# EAGLE design breakout-4x-step-down (EAGLE 7.5.0)
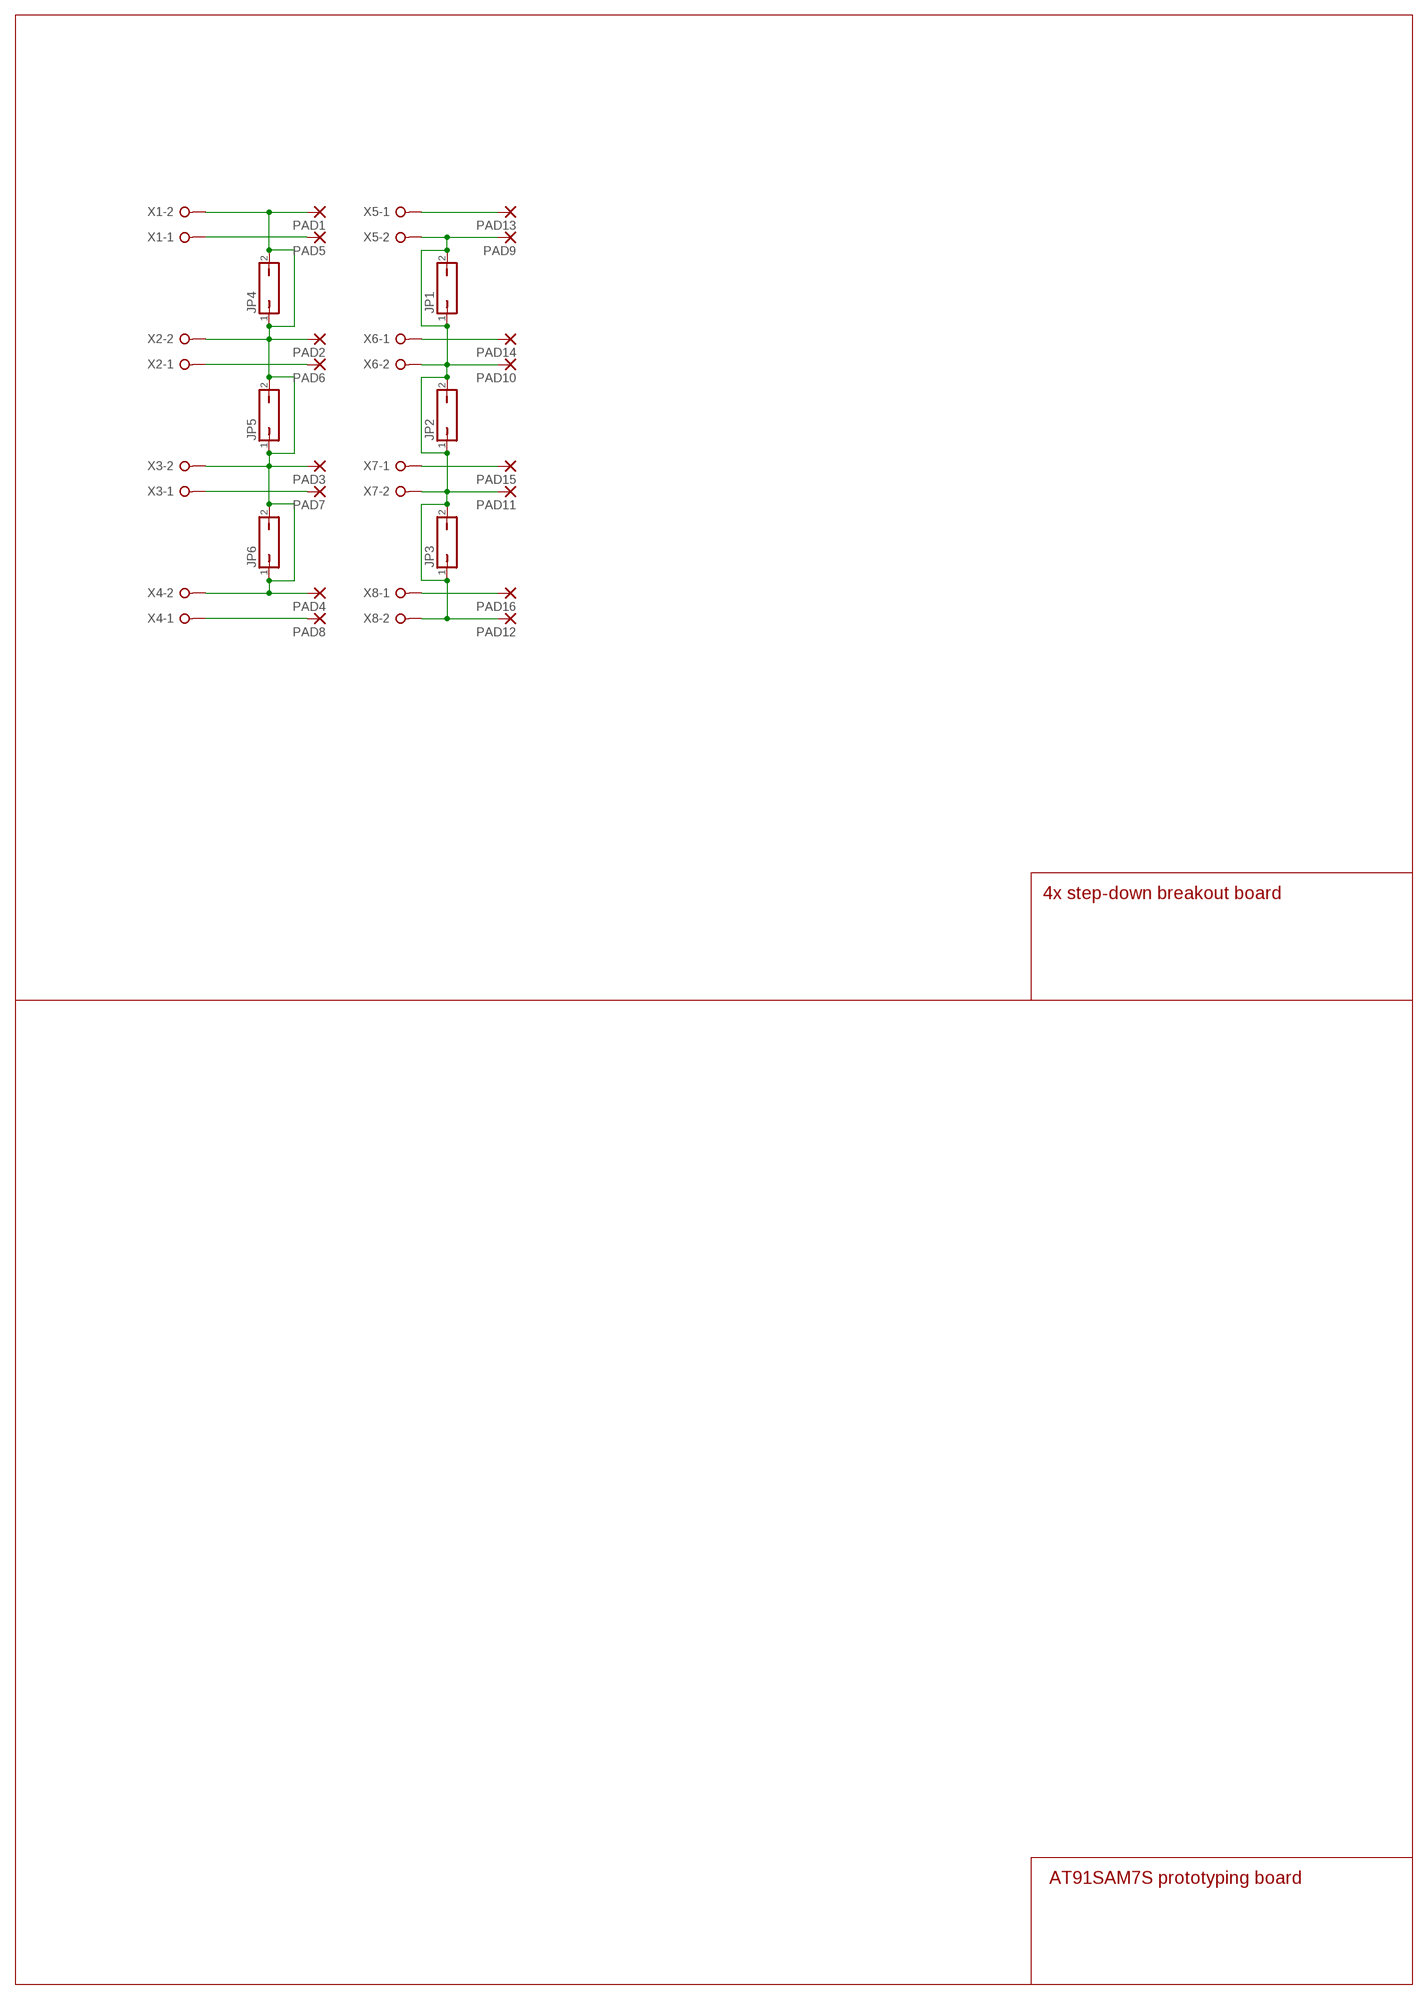
[diagram p0: schematic, sheet 1]

## Parts
JP1  JP1Q  [JP1]
JP2  JP1Q  [JP1]
JP3  JP1Q  [JP1]
JP4  JP1Q  [JP1]
JP5  JP1Q  [JP1]
JP6  JP1Q  [JP1]
PAD1  1,6/0,8  [1,6/0,8]
PAD2  1,6/0,8  [1,6/0,8]
PAD3  1,6/0,8  [1,6/0,8]
PAD4  1,6/0,8  [1,6/0,8]
PAD5  1,6/0,8  [1,6/0,8]
PAD6  1,6/0,8  [1,6/0,8]
PAD7  1,6/0,8  [1,6/0,8]
PAD8  1,6/0,8  [1,6/0,8]
PAD9  1,6/0,8  [1,6/0,8]
PAD10  1,6/0,8  [1,6/0,8]
PAD11  1,6/0,8  [1,6/0,8]
PAD12  1,6/0,8  [1,6/0,8]
PAD13  1,6/0,8  [1,6/0,8]
PAD14  1,6/0,8  [1,6/0,8]
PAD15  1,6/0,8  [1,6/0,8]
PAD16  1,6/0,8  [1,6/0,8]
X1  W237-02P  [W237-132]
X2  W237-02P  [W237-132]
X3  W237-02P  [W237-132]
X4  W237-02P  [W237-132]
X5  W237-02P  [W237-132]
X6  W237-02P  [W237-132]
X7  W237-02P  [W237-132]
X8  W237-02P  [W237-132]

## Nets
N$5: JP4.1 JP4.2 JP5.1 JP5.2 JP6.1 JP6.2 PAD1.1(P) PAD2.1(P) PAD3.1(P) PAD4.1(P) X1.2 X2.2 X3.2 X4.2
N$7: PAD5.1(P) X1.1
N$8: JP1.1 JP1.2 JP2.1 JP2.2 JP3.1 JP3.2 PAD9.1(P) PAD10.1(P) PAD11.1(P) PAD12.1(P) X5.2 X6.2 X7.2 X8.2
N$9: PAD6.1(P) X2.1
N$11: PAD7.1(P) X3.1
N$12: PAD8.1(P) X4.1
N$13: PAD16.1(P) X8.1
N$14: PAD15.1(P) X7.1
N$15: PAD14.1(P) X6.1
N$16: PAD13.1(P) X5.1

## Notes on the sheet
- 4x step-down breakout board
- AT91SAM7S prototyping board

## Library data of the parts
JP1-JP6 = jumper:JP1Q: JUMPER
PAD1-PAD16 = wirepad:1,6/0,8: THROUGH-HOLE PAD
X1-X8 = con-wago-508:W237-02P: WAGO SREW CLAMP; OC_FARNELL: unknown; OC_NEWARK: unknown

## Board
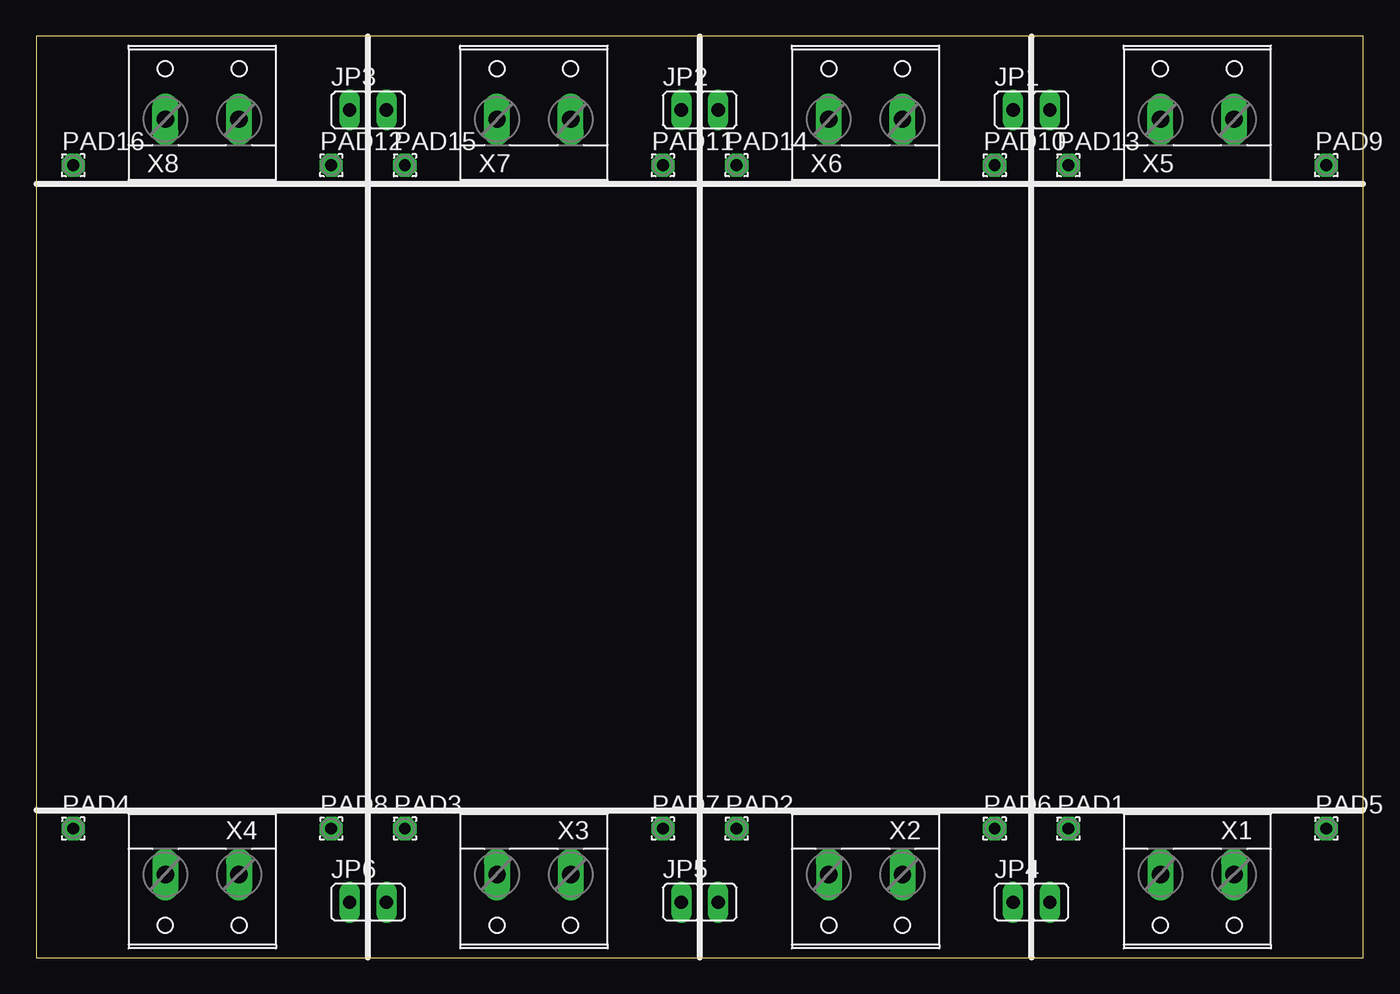
[diagram p1: board, top side]
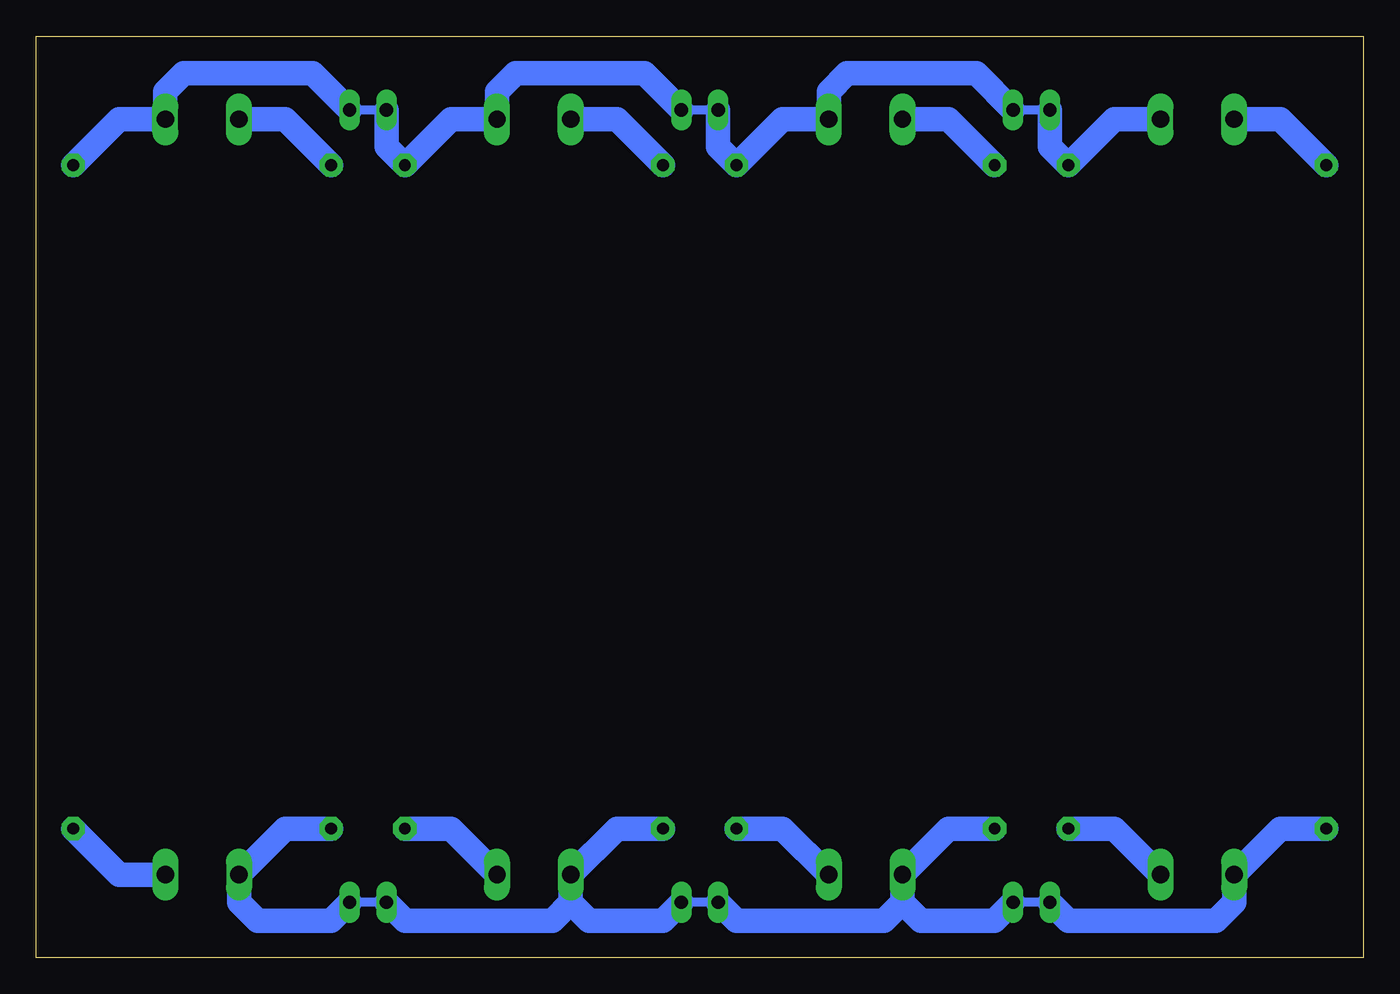
[diagram p2: board, bottom side, seen from below]

Size 91.45 x 63.51 mm. Coordinates in mm from the lower left corner, seen from the top.
Outline: 0.01,0 91.45,0 91.45,63.5 0,63.51 0.01,0
Copper layers (1*16): Top 0.035mm / dielectric 1.5mm / Bottom 0.035mm
Design rules "default": minimum track width 10mil, minimum drill 24mil, track to track 8mil, track to pad 8mil, pad to pad 8mil, via to via 8mil, smd to smd 8mil, copper to edge 40mil, drill to drill 8mil, minimum pad ring 10mil, minimum via ring 8mil, stop-mask expansion 4mil, vias tented up to drill 0mil, thermal gap 10mil

### Footprints (pad centres in the part's own frame; a part is rotated, then mirrored left to right if it is on the bottom)
JP1 = drill 0.914 long: 1 0,-1.27; 2 0,1.27
1,6/0,8 = drill 0.813 pad 1.6 octagon: 1 0,0
W237-132 = drill 1.194 long: 1 -2.54,-0.635; 2 2.54,-0.635

### Placement (x,y rotation side)
JP1  68.59,58.43 270 top
JP2  45.73,58.43 270 top
JP3  22.87,58.43 270 top
JP4  68.59,3.82 270 top
JP5  45.73,3.82 270 top
JP6  22.87,3.82 270 top
PAD1  71.13,8.9 0 top
PAD2  48.27,8.9 0 top
PAD3  25.41,8.9 0 top
PAD4  2.55,8.9 0 top
PAD5  88.91,8.9 0 top
PAD6  66.05,8.9 0 top
PAD7  43.19,8.9 0 top
PAD8  20.33,8.9 0 top
PAD9  88.91,54.62 0 top
PAD10  66.05,54.62 0 top
PAD11  43.19,54.62 0 top
PAD12  20.33,54.62 0 top
PAD13  71.13,54.62 0 top
PAD14  48.27,54.62 0 top
PAD15  25.41,54.62 0 top
PAD16  2.55,54.62 0 top
X1  80.02,5.09 180 top
X2  57.16,5.09 180 top
X3  34.3,5.09 180 top
X4  11.44,5.09 180 top
X5  80.02,58.43 0 top
X6  57.16,58.43 0 top
X7  34.3,58.43 0 top
X8  11.44,58.43 0 top

### Tracks (layer width: path | path; a pad name or v marks a point on that pad's centre or on a via)
N$5
  Bottom 0.61: JP6.1 JP6.2 | JP5.1 JP5.2 | JP4.1 JP4.2
  Bottom 1.676: PAD4.1 5.72,8.9 X4.2 8.9,3.82 10.17,2.55 20.33,2.55 JP6.1 | PAD3.1 28.58,8.9 X3.2 31.76,3.82 | PAD2.1 51.44,8.9 X2.2 54.62,3.82 | PAD1.1 74.3,8.9 X1.2 77.48,3.82 76.21,2.55 71.13,2.55 JP4.2 | 31.76,3.82 33.03,2.55 43.19,2.55 JP5.1 | 54.62,3.82 55.89,2.55 66.05,2.55 JP4.1 | JP5.2 48.27,2.55 53.35,2.55 54.62,3.82 | JP6.2 25.41,2.55 30.49,2.55 31.76,3.82
N$7
  Bottom 1.676: X1.1 85.73,5.72 PAD5.1
N$8
  Bottom 0.61: JP1.1 JP1.2 | JP2.1 JP2.2 | JP3.1 JP3.2
  Bottom 1.676: X8.2 17.15,57.79 PAD12.1 21.6,55.89 JP3.1 | PAD9.1 85.73,57.79 X5.2 82.56,59.7 81.29,60.97 72.4,60.97 JP1.2 | JP3.2 26.68,60.97 35.57,60.97 36.84,59.7 X7.2 40.01,57.79 PAD11.1 44.46,55.89 JP2.1 | JP2.2 49.54,60.97 58.43,60.97 59.7,59.7 X6.2 62.87,57.79 PAD10.1 67.32,55.89 JP1.1
N$9
  Bottom 1.676: PAD6.1 62.87,8.9 X2.1
N$11
  Bottom 1.676: PAD7.1 40.01,8.9 X3.1
N$12
  Bottom 1.676: 14.61,6.36 X4.1 17.15,8.9 PAD8.1
N$13
  Bottom 1.676: X8.1 5.72,57.79 PAD16.1
N$14
  Bottom 1.676: X7.1 28.58,57.79 PAD15.1
N$15
  Bottom 1.676: X6.1 51.44,57.79 PAD14.1
N$16
  Bottom 1.676: X5.1 74.3,57.79 PAD13.1